# EAGLE design AVR-ISP-MK2 (EAGLE 9.5.2)
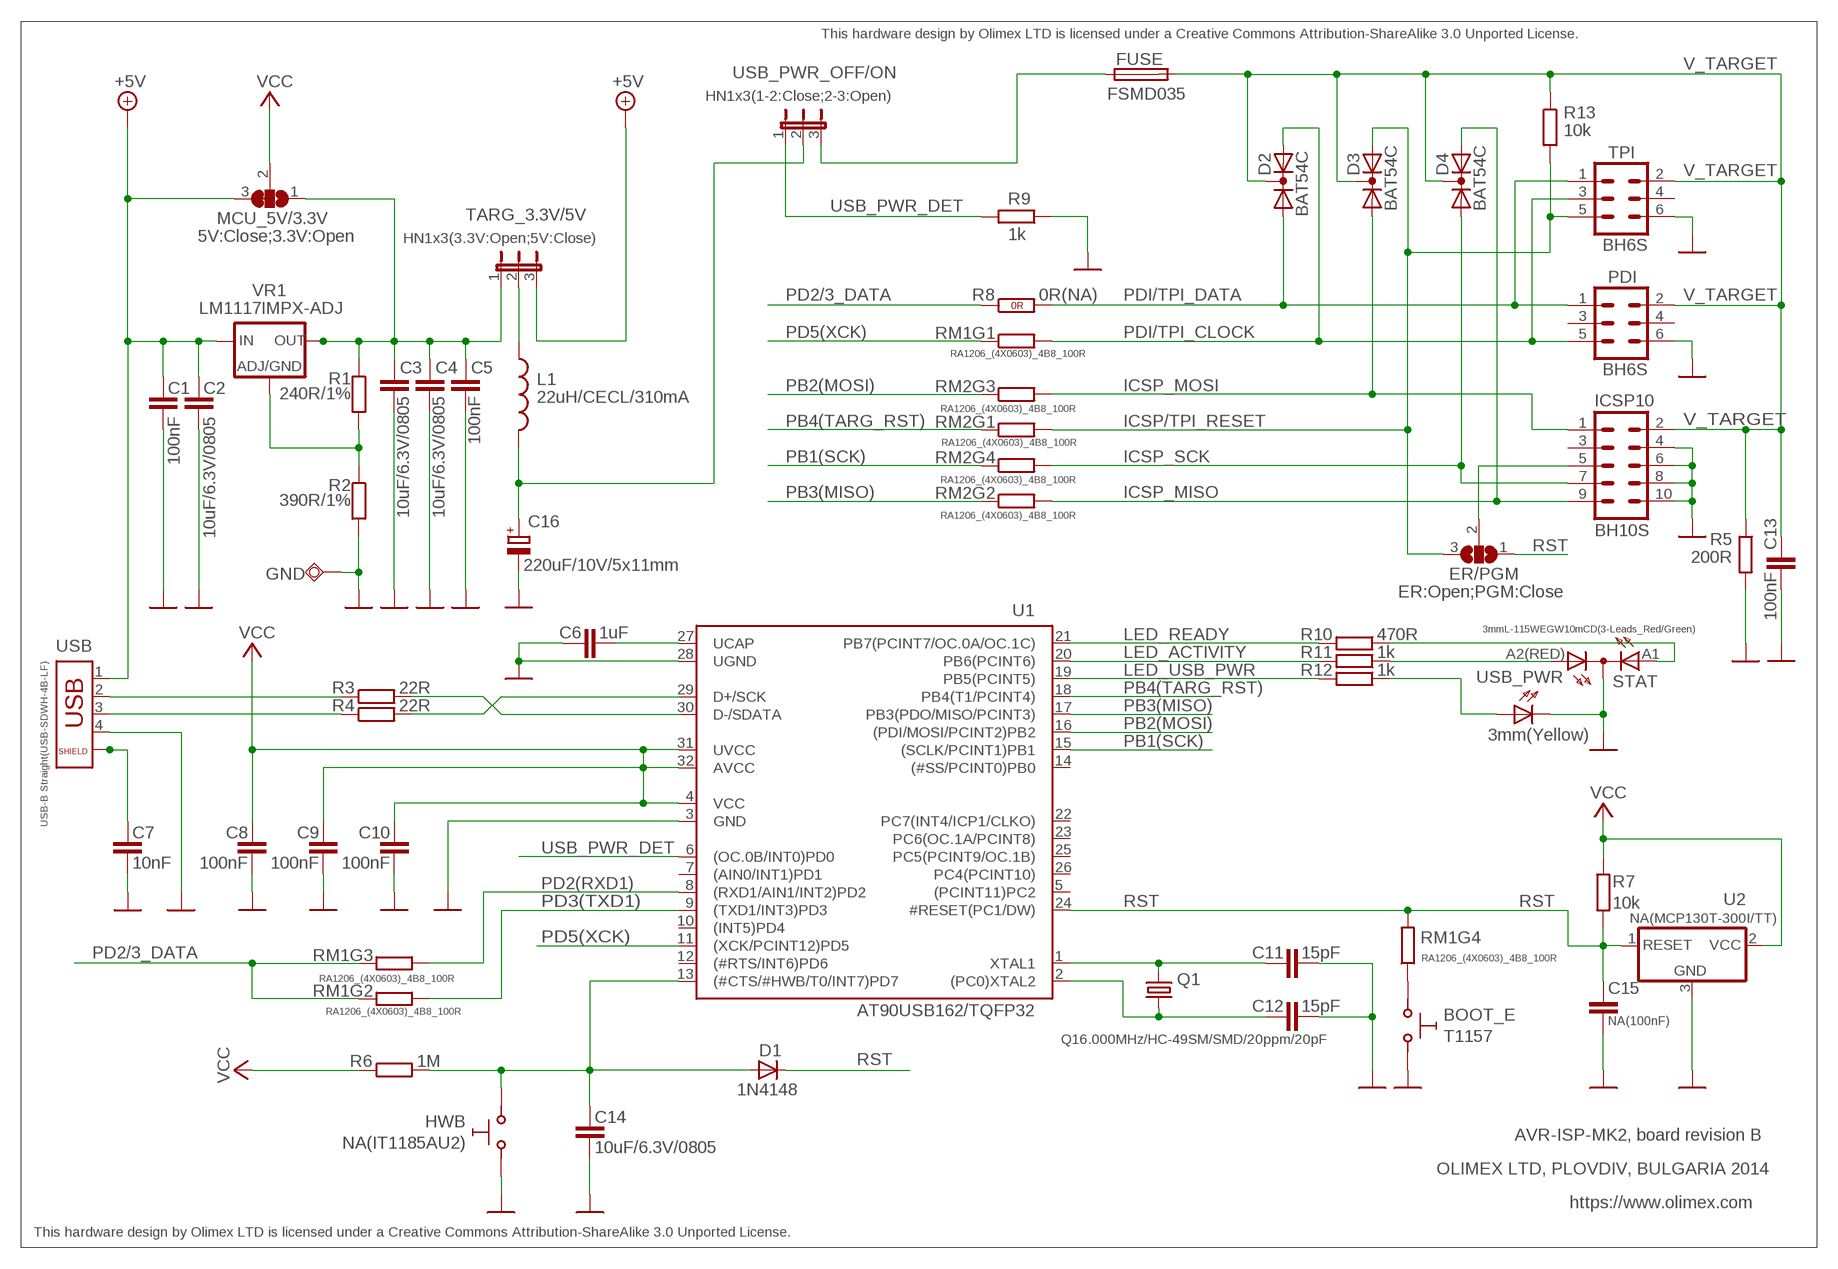
[diagram p0: schematic, sheet 1]

## Parts
BOOT_E  T1157  SW-TAKT""  [T1157]
C1  100nF  C-EUC0603_DWS  [C0603_DWS]
C2  10uF/6.3V/0805  C-EUC0805_5MIL_DWS  [C0805_5MIL_DWS]
C3  10uF/6.3V/0805  C-EUC0805_5MIL_DWS  [C0805_5MIL_DWS]
C4  10uF/6.3V/0805  C-EUC0805_5MIL_DWS  [C0805_5MIL_DWS]
C5  100nF  C-EUC0603_DWS  [C0603_DWS]
C6  1uF  C-EUC0603_DWS  [C0603_DWS]
C7  10nF  C-EUC0603_DWS  [C0603_DWS]
C8  100nF  C-EUC0603_DWS  [C0603_DWS]
C9  100nF  C-EUC0603_DWS  [C0603_DWS]
C10  100nF  C-EUC0603_DWS  [C0603_DWS]
C11  15pF  C-EUC0603_DWS  [C0603_DWS]
C12  15pF  C-EUC0603_DWS  [C0603_DWS]
C13  100nF  C-EUC0603_DWS  [C0603_DWS]
C14  10uF/6.3V/0805  C-EUC0805_5MIL_DWS  [C0805_5MIL_DWS]
C15  NA(100nF)  C-EUC0603_DWS_NA  [C0603_DWS_NA]
C16  220uF/10V/5x11mm  CPOL-EUC-SMD5X11  [C-SMD5X11]
D1  1N4148  DSMD  [MINI-MELF]
D2  BAT54C  DIODE_AC-CA_  [SOT23C]
D3  BAT54C  DIODE_AC-CA_  [SOT23C]
D4  BAT54C  DIODE_AC-CA_  [SOT23C]
ER/PGM  ER:Open;PGM:Close  SJ2W  [SJ_2]
FUSE  FSMD035  FUSE  [1206]
GND  TESTPAD3  [TEST_PAD40/70/SQUARE]
HWB  NA(IT1185AU2)  SW-TAKTIT1185AU2  [IT1185AU2]
ICSP10  BH10S  ML10SMD  [ML10_PADS]
L1  22uH/CECL/310mA  L-USCECL  [L_CECL]
MCU_5V/3.3V  5V:Close;3.3V:Open  SJ2W  [SJ_2]
PDI  BH6S  ML6ML6_PADS  [ML6_PADS]
Q1  Q16.000MHz/HC-49SM/SMD/20ppm/20pF  HC49/S1  [HC49/SMD2_THIN]
R1  240R/1%  R-EU_R0603_5MIL_DWS  [R0603_5MIL_DWS]
R2  390R/1%  R-EU_R0603_5MIL_DWS  [R0603_5MIL_DWS]
R3  22R  R-EU_R0603_5MIL_DWS  [R0603_5MIL_DWS]
R4  22R  R-EU_R0603_5MIL_DWS  [R0603_5MIL_DWS]
R5  200R  R-EU_R0805_5MIL_DWS  [R0805_5MIL_DWS]
R6  1M  R-EU_R0603_5MIL_DWS  [R0603_5MIL_DWS]
R7  10k  R-EU_R0603_5MIL_DWS  [R0603_5MIL_DWS]
R8  0R(NA)  R_0R0R(NA)  [0603_0R]
R9  1k  R-EU_R0603_5MIL_DWS  [R0603_5MIL_DWS]
R10  470R  R-EU_R0603_5MIL_DWS  [R0603_5MIL_DWS]
R11  1k  R-EU_R0603_5MIL_DWS  [R0603_5MIL_DWS]
R12  1k  R-EU_R0603_5MIL_DWS  [R0603_5MIL_DWS]
R13  10k  R-EU_R0603_5MIL_DWS  [R0603_5MIL_DWS]
RM1  RA1206_(4X0603)_4B8_100R  R_MATRIX_4E  [R_MATRIX_4]
RM2  RA1206_(4X0603)_4B8_100R  R_MATRIX_4E  [R_MATRIX_4]
STAT  3mmL-115WEGW10mCD(3-Leads_Red/Green)  2X3MMLED  [2X3MMLED]
TARG_3.3V/5V  HN1x3(3.3V:Open;5V:Close)  JP2EHN1X3_SMD_MIRROR  [HN1X3-SMD_MIRROR]
TPI  BH6S  ML6ML6_PADS  [ML6_PADS]
U1  AT90USB162/TQFP32  AT90USB82/162TQFP32  [TQFP32]
U2  NA(MCP130T-300I/TT)  RESETMCP130T-300-I/TT  [SOT23]
USB  USB-B Straight(USB-SDWH-4B-LF)  USB_SHIELDUSB_B_SMD  [USB_PADS]
USB_PWR  3mm(Yellow)  LED3.0MM  [LED-3.0MM]
USB_PWR_OFF/ON  HN1x3(1-2:Close;2-3:Open)  JP2EHN1X3-SMD  [HN1X3-SMD]
VR1  LM1117IMPX-ADJ  LM1117THERMAL_OFF  [SOT223_]

## Nets
+5V [PWR]: C1.1 C2.1 MCU_5V/3.3V.3 TARG_3.3V/5V.3 USB.1 VR1.3(IN)
GND [PWR]: BOOT_E.2 C1.2 C2.2 C3.2 C4.2 C5.2 C6.2 C7.2 C8.2 C9.2 C10.2 C11.1 C12.1 C13.2 C14.2 C15.2 C16.- GND.P$1(PP) HWB.2 ICSP10.4 ICSP10.6 ICSP10.8 ICSP10.10 PDI.6 R2.2 R5.2 R9.1 STAT.C TPI.6 U1.3(GND) U1.28(UGND) U2.3(GND) USB.4 USB_PWR.K(C)
ICSP/TPI_RESET: D3.1(A1) ER/PGM.3 R13.2 RM2.1.2 TPI.5
ICSP_MISO: D4.1(A1) ICSP10.9 RM2.2.2
ICSP_MOSI: D3.2(A2) ICSP10.1 RM2.3.2
ICSP_SCK: D4.2(A2) ICSP10.7 RM2.4.2
LED_ACTIVITY: R11.2 U1.20(PB6(PCINT6))
LED_READY: R10.2 U1.21(PB7(PCINT7/OC.0A/OC.1C))
LED_USB_PWR: R12.2 U1.19(PB5(PCINT5))
N$1: C14.1 D1.A HWB.1 R6.2 U1.13((#CTS/#HWB/T0/INT7)PD7)
N$2 [PWR]: C7.1 USB.P$5 USB.P$6
N$3: R11.1 STAT.A2(RED)(AR)
N$4: R12.1 USB_PWR.A
N$5: C3.1 C4.1 C5.1 MCU_5V/3.3V.1 R1.1 TARG_3.3V/5V.1 VR1.2(OUT) VR1.4(RAD)
N$6: R1.2 R2.1 VR1.1(ADJ/GND)
N$7: BOOT_E.1 RM1.4.1
N$8 [PWR]: L1.1 TARG_3.3V/5V.2
N$9: C16.+ L1.2 USB_PWR_OFF/ON.2
N$10: C6.1 U1.27(UCAP)
N$11: ER/PGM.2 ICSP10.5
N$12: FUSE.1 USB_PWR_OFF/ON.3
N$25: R10.1 STAT.A1(AG)
N$40: C11.2 Q1.2 U1.1(XTAL1)
N$42: C12.2 Q1.1 U1.2((PC0)XTAL2)
N$44: R3.2 U1.30(D-/SDATA)
N$45: R4.2 U1.29(D+/SCK)
N$438: R3.1 USB.2
N$537: R4.1 USB.3
PB1(SCK): RM2.4.1 U1.15((SCLK/PCINT1)PB1)
PB2(MOSI): RM2.3.1 U1.16((PDI/MOSI/PCINT2)PB2)
PB3(MISO): RM2.2.1 U1.17(PB3(PDO/MISO/PCINT3))
PB4(TARG_RST): RM2.1.1 U1.18(PB4(T1/PCINT4))
PD2(RXD1): RM1.3.1 U1.8((RXD1/AIN1/INT2)PD2)
PD2/3_DATA: R8.1(1.1) RM1.2.2 RM1.3.2
PD3(TXD1): RM1.2.1 U1.9((TXD1/INT3)PD3)
PD5(XCK): RM1.1.1 U1.11((XCK/PCINT12)PD5)
PDI/TPI_CLOCK: D2.2(A2) PDI.5 RM1.1.2 TPI.3
PDI/TPI_DATA: D2.1(A1) PDI.1 R8.2(1.2) TPI.1
RST: C15.1 D1.C(K) ER/PGM.1 R7.2 RM1.4.2 U1.24(#RESET(PC1/DW)) U2.1(RESET)
USB_PWR_DET: R9.2 U1.6((OC.0B/INT0)PD0) USB_PWR_OFF/ON.1
V_TARGET: C13.1 D2.3(K) D3.3(K) D4.3(K) FUSE.2 ICSP10.2 PDI.2 R5.1 R13.1 TPI.2
VCC: C8.1 C9.1 C10.1 MCU_5V/3.3V.2 R6.1 R7.1 U1.4(VCC) U1.31(UVCC) U1.32(AVCC) U2.2(VCC)
Unconnected: ICSP10.3 PDI.3 PDI.4 TPI.4 U1.5((PCINT11)PC2) U1.7((AIN0/INT1)PD1) U1.10((INT5)PD4) U1.12((#RTS/INT6)PD6) U1.14((#SS/PCINT0)PB0) U1.22(PC7(INT4/ICP1/CLKO)) U1.23(PC6(OC.1A/PCINT8)) U1.25(PC5(PCINT9/OC.1B)) U1.26(PC4(PCINT10))

## Notes on the sheet
- This hardware design by Olimex LTD is licensed under a Creative Commons Attribution-ShareAlike 3.0 Unported License.
- AVR-ISP-MK2, board revision B
- OLIMEX LTD, PLOVDIV, BULGARIA 2014
- https://www.olimex.com
- This hardware design by Olimex LTD is licensed under a Creative Commons Attribution-ShareAlike 3.0 Unported License.

## Library data of the parts
BOOT_E HWB = gogo:SW-TAKT
C1-C15 = rcl:C-EU: CAPACITOR, European symbol
C16 = rcl:CPOL-EU: POLARIZED CAPACITOR, European symbol
D1 = DOUBLE-SIDE:D: DIODES
D2-D4 = semicon-smd-ipc:DIODE_AC-CA_: DUAL DIODE
ER/PGM MCU_5V/3.3V = jumper:SJ2W: SMD solder JUMPER
FUSE = gogo:FUSE
GND = gogo:TESTPAD: drill 40mils, diameter 70mils
ICSP10 = con-harting-ml:ML10: HARTING
L1 = rcl:L-US: INDUCTOR, American symbol
PDI TPI = con-harting-ml:ML6: HARTING
Q1 = crystal:HC49/S: CRYSTAL
R1-R7 R9-R13 = rcl:R-EU_: RESISTOR, European symbol
R8 = OLIMEX_DISCRET:R_0R
RM1 RM2 = OLIMEX_DISCRET:R_MATRIX_4E
STAT = gogo:2X3MMLED: COMMON CATHODE
TARG_3.3V/5V USB_PWR_OFF/ON = jumper:JP2E: JUMPER
U1 = OLIMEX_IC:AT90USB82/162
U2 = gogo:RESET: Microcontroller Supervisory Circuit with Open Drain Output
USB = OLIMEX_CONNECTORS:USB_SHIELD
USB_PWR = DOUBLE-SIDE:LED
VR1 = arm:LM1117

## Net classes
1 PWR: width 0.5 mm

## Board
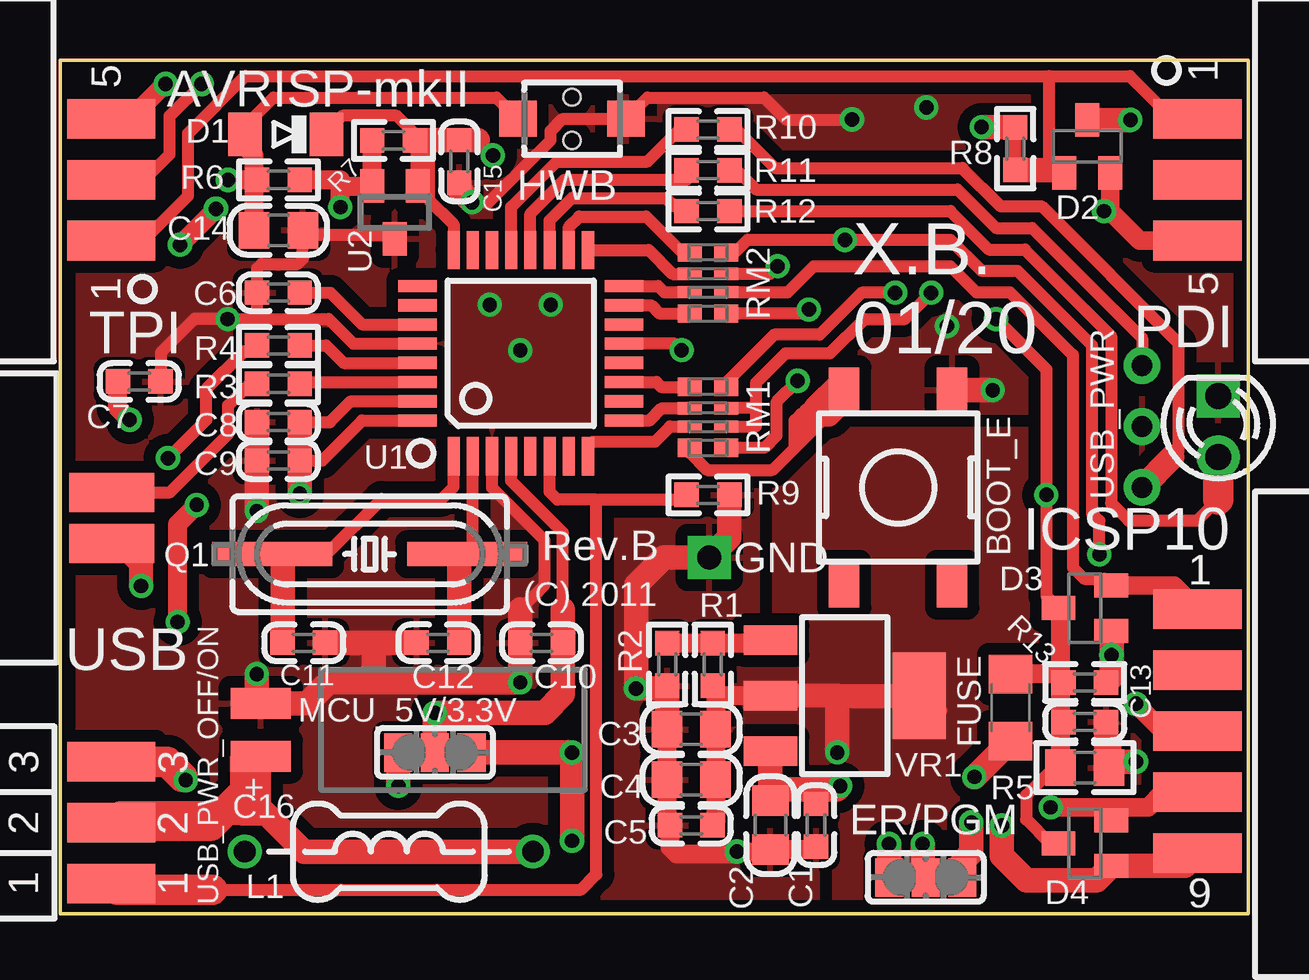
[diagram p1: board, top side]
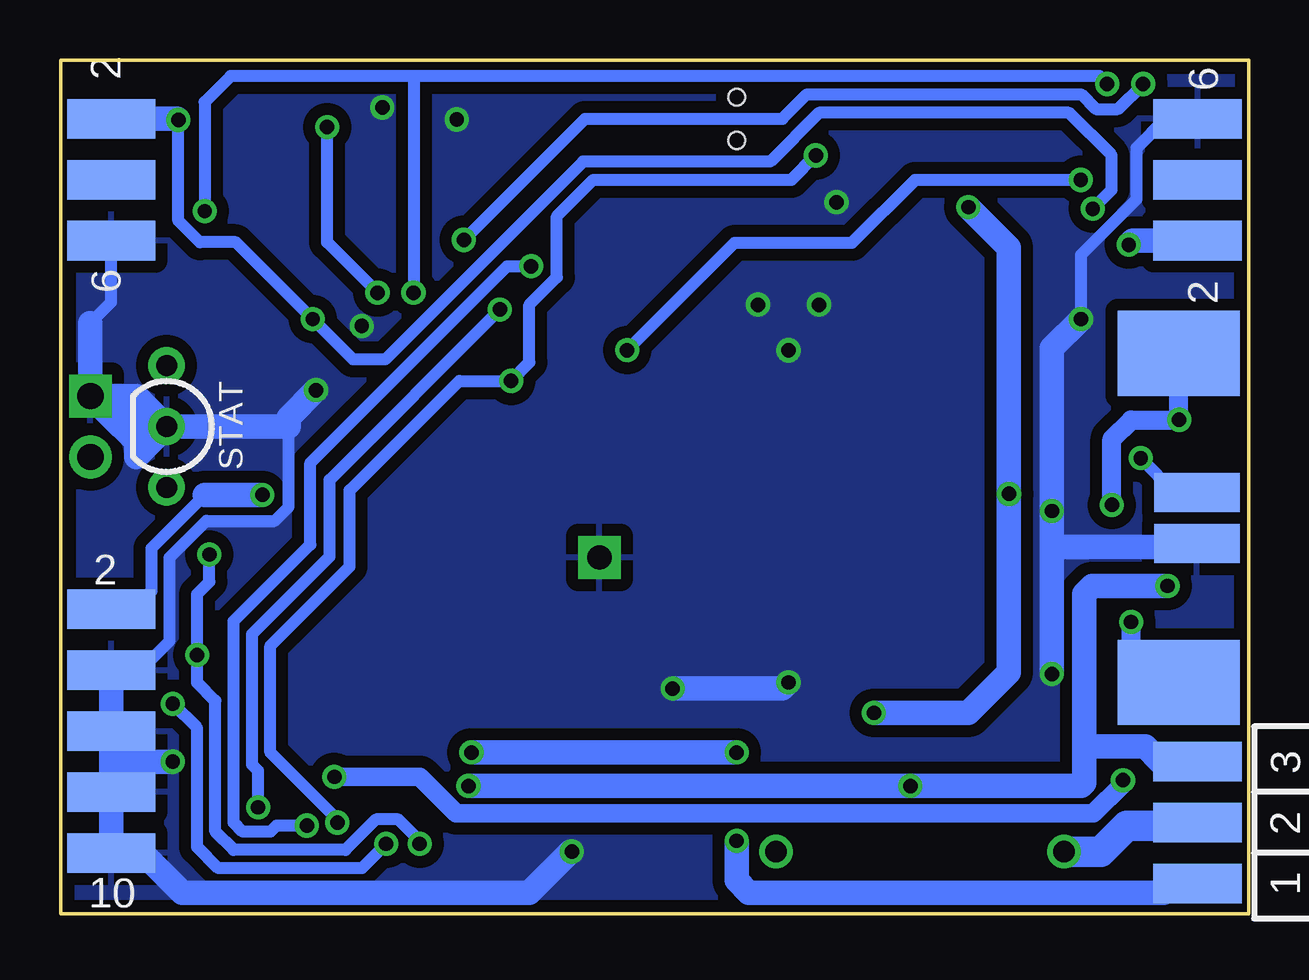
[diagram p2: board, bottom side, seen from below]

Size 49.5 x 35.6 mm. Coordinates in mm from the lower left corner, seen from the top.
Outline: 0,0 49.5,0 49.5,35.6 0,35.6 0,0
Copper layers (1+16): Top 0.035mm / dielectric 1.5mm / Bottom 0.035mm
Design rules "default": minimum track width 10mil, minimum drill 0.6mm, track to track 10mil, track to pad 10mil, pad to pad 10mil, via to via 10mil, smd to smd 1mil, copper to edge 10mil, drill to drill 8mil, minimum pad ring 10mil, minimum via ring 8mil, stop-mask expansion 4mil, vias tented up to drill 25mil, thermal gap 20mil
tRestrict: 2 lines
bRestrict: 2 lines

### Footprints (pad centres in the part's own frame; a part is rotated, then mirrored left to right if it is on the bottom)
T1157 = smd 1.27 x 1.905: 1 -2.25,4.054; 2 2.25,4.054; 3 2.25,-4.054; 4 -2.25,-4.054
C0603_DWS = smd 1.016 x 1.016: 1 -0.889,0; 2 0.889,0
C0805_5MIL_DWS = smd 1.27 x 1.524: 1 -1.016,0; 2 1.016,0
C0603_DWS_NA = smd 1.016 x 1.016: 1 -0.889,0; 2 0.889,0
C-SMD5X11 = smd 2.5 x 1.3: + 0,1.1; - 0,-1.1
MINI-MELF = smd 1.4 x 1.8: A 1.7,0; C -1.7,0
SOT23C = smd 1 x 1.4: 1 -0.95,-1.1; 2 0.95,-1.1; 3 0,1.1
SJ_2 = smd 1.168 x 1.6: 1 -1.524,0; 2 0,0; 3 1.524,0
1206 = smd 1.6 x 1.8: 1 -1.4,0; 2 1.4,0
TEST_PAD40/70/SQUARE = drill 1.016 pad 1.778 square: P$1 0,0
IT1185AU2 = smd 1.55 x 1.5: 1 -2.25,0; 2 2.25,0 | hole 0.7: 0,-0.9; 0,0.9
ML10_PADS = smd 1.651 x 3.683: 1 -5.08,-0.229; 3 -2.54,-0.229; 5 0,-0.229; 7 2.54,-0.229; 9 5.08,-0.229 | smd 1.651 x 3.683 bottom: 2 -5.08,-0.229; 4 -2.54,-0.229; 6 0,-0.229; 8 2.54,-0.229; 10 5.08,-0.229
L_CECL = drill 0.9: 1 -6,0; 2 6,0
ML6_PADS = smd 1.651 x 3.683: 1 -2.54,-0.229; 3 0,-0.229; 5 2.54,-0.229 | smd 1.651 x 3.683 bottom: 2 -2.54,-0.229; 4 0,-0.229; 6 2.54,-0.229
HC49/SMD2_THIN = smd 5 x 1: 1 -4.064,0; 2 4.064,0
R0603_5MIL_DWS = smd 1.016 x 1.016: 1 -0.889,0; 2 0.889,0
R0805_5MIL_DWS = smd 1.27 x 1.524: 1 -1.016,0; 2 1.016,0
0603_0R = smd 1.016 x 1.016: 1 -0.889,0; 2 0.889,0
R_MATRIX_4 = smd 1.016 x 0.762: 1.1 -0.762,1.27; 1.2 0.762,1.27; 4.1 -0.762,-1.27; 4.2 0.762,-1.27 | smd 1.016 x 0.508: 2.1 -0.762,0.381; 2.2 0.762,0.381; 3.1 -0.762,-0.381; 3.2 0.762,-0.381
2X3MMLED = drill 0.864 pad 1.524: A1 -2.54,0; A2(RED) 2.54,0; C 0,0
HN1X3-SMD_MIRROR = smd 1.651 x 3.683: 1 2.54,-0.229; 2 0,-0.229; 3 -2.54,-0.229
TQFP32 = smd 0.508 x 1.6: 1 -2.8,-4.3; 2 -2,-4.3; 3 -1.2,-4.3; 4 -0.4,-4.3; 5 0.4,-4.3; 6 1.2,-4.3; 7 2,-4.3; 8 2.8,-4.3; 17 2.8,4.3; 18 2,4.3; 19 1.2,4.3; 20 0.4,4.3; 21 -0.4,4.3; 22 -1.2,4.3; 23 -2,4.3; 24 -2.8,4.3 | smd 1.6 x 0.508: 9 4.3,-2.8; 10 4.3,-2; 11 4.3,-1.2; 12 4.3,-0.4; 13 4.3,0.4; 14 4.3,1.2; 15 4.3,2; 16 4.3,2.8; 25 -4.3,2.8; 26 -4.3,2; 27 -4.3,1.2; 28 -4.3,0.4; 29 -4.3,-0.4; 30 -4.3,-1.2; 31 -4.3,-2; 32 -4.3,-2.8
SOT23 = smd 1 x 1.4: 1 -0.95,-1.1; 2 0.95,-1.1; 3 0,1.1
USB_PADS = smd 1.626 x 3.556: 1 1.067,10.287; 2 -1.067,10.287 | smd 1.626 x 3.556 bottom: 3 -1.067,10.287; 4 1.067,10.287 | smd 3.556 x 5.08 bottom: P$5 -6.858,11.049; P$6 6.858,11.049
LED-3.0MM = drill 1.092 pad 1.778: A -1.27,0 | drill 1.092 pad 1.778 square: K 1.27,0
HN1X3-SMD = smd 1.651 x 3.683: 1 -2.54,-0.229; 2 0,-0.229; 3 2.54,-0.229
SOT223_ = smd 1.219 x 2.235: 1 -2.311,-3.099; 2 0,-3.099; 3 2.311,-3.099 | smd 3.6 x 2.2: 4 0,3.099

### Placement (x,y rotation side)
BOOT_E  34.92,17.78 0 top
C1  31.5,3.7 270 top
C2  29.6,3.7 270 top
C3  26.3,7.7 180 top
C4  26.3,5.6 180 top
C5  26.3,3.7 180 top
C6  9.1,25.9 180 top
C7  3.3,22.2 0 top
C8  9.1,20.5 180 top
C9  9.1,18.9 180 top
C10  20.07,11.3 180 top
C11  10.16,11.3 180 top
C12  15.75,11.3 0 top
C13  42.7,8 0 top
C14  9.1,28.5 0 top
C15  16.64,31.37 270 top
C16  8.37,7.67 180 top
D1  9.4,32.5 180 top
D2  42.8,32 0 top
D3  42.7,12.75 90 top
D4  42.7,2.95 90 top
ER/PGM  36.07,1.52 180 top
FUSE  39.6,8.6 90 top
GND  27.05,14.86 0 top
HWB  21.34,33.15 0 top
ICSP10  47.62,7.62 270 top
L1  13.7,2.6 0 top
MCU_5V/3.3V  15.62,6.73 180 top
PDI  47.62,30.61 270 top
Q1  12.9,15 180 top
R1  27.2,10.4 90 top
R2  25.3,10.4 270 top
R3  9.1,22.1 0 top
R4  9.1,23.7 0 top
R5  42.7,6.1 0 top
R6  9.1,30.6 180 top
R7  13.9,32.25 0 top
R8  39.8,31.9 270 top
R9  27,17.47 180 top
R10  27,32.7 180 top
R11  27,31 180 top
R12  27,29.3 180 top
R13  42.7,9.65 0 top
RM1  27,20.7 0 top
RM2  27,26.3 0 top
STAT  45.09,20.32 90 bottom
TARG_3.3V/5V  1.91,3.81 270 bottom
TPI  1.91,30.61 90 top
U1  19.2,23.37 0 top
U2  13.95,29.25 180 top
USB  -8.13,16.51 270 top
USB_PWR  48.26,20.32 90 top
USB_PWR_OFF/ON  1.91,3.81 90 top
VR1  32.7,9.1 270 top

### Tracks (layer width: path | path; a pad name or v marks a point on that pad's centre or on a via)
+5V  (via drill 0.6)
  Top 0.5: 29.6,5.2
  Top 0.508: MCU_5V/3.3V.3 15.62,6.73
  Top 0.8: 31.5,5.2 C1.1 | 29.6,5.2 C2.1
  Top 1: USB.1 2.56,15.44 3.38,14.62 v3.38,13.67
  Top 1.016: VR1.3 29.6,5.2 31.5,5.2 32.38,5.2 v32.51,5.33 | v14.1,5.33 MCU_5V/3.3V.3
  Bottom 1.016: 6.86,6.99 6.86,5.46 6.99,5.33 v14.1,5.33 v32.51,5.33 | v3.38,13.67 6.52,13.67 6.86,13.34 6.86,6.99 | TARG_3.3V/5V.3 3.68,6.35 4.32,6.99 6.86,6.99
GND  (via drill 0.6)
  Top 0.5: U1.28 12.22,23.77 11.19,24.8 8.21,24.8 | 8.21,24.8 C6.2 8.21,26.91 8.4,27.1 9.9,27.1 10.12,27.32 10.12,28.32 | 8.21,24.8 v6.99,24.8 5.6,24.8 4.2,23.4 C7.2 | 29.52,2.6 C2.2 | 25.3,7.72 C3.2 | U1.3 18,17.76 20.19,15.57 20.19,13.72 19.18,12.7 | R5.2 43.7,6.1 | 10.12,28.32 13.95,28.32 U2.3 | 10.12,28.32 C14.2
  Top 0.508: v33,33.12 30.25,33.12 29.34,34.04 24.48,34.04 HWB.2 20.95,33.15 20.45,32.64 20.45,32.26 17.86,29.67 v17.17,29.67
  Top 0.8: C3.2 C4.2 25.28,3.83 C5.2 25.41,2.79 25.7,2.5 28.1,2.5 v28.2,2.6 29.52,2.6 | C2.2 31.37,2.68 C1.2
  Top 1.016: C8.2 C9.2 8.21,18.91 C9.2 v8.2,16.8 | 25.3,8.78 25.3,7.72 | 25.3,8.78 R2.2 | 13.08,9.65 13.08,11.3 | 13.08,11.3 C11.1 | 13.08,11.3 C12.1 | 19.18,12.7 C10.2 v19.18,9.65 13.08,9.65 | 13.08,9.65 11.18,9.65 10.3,8.78 C16.- 8.2,8.78 v8.2,10 | v38.87,21.83 BOOT_E.2 | R9.1 27.89,15.7 GND.P$1 25.15,14.86 24,13.72 v24,9.4 25.3,9.4 25.3,8.78 | v44.83,6.35 43.72,6.35 | C13.2 43.59,6.99 43.72,6.99 43.72,6.35 | 43.72,6.35 R5.2 | v17.17,29.67 16.64,30.2 C15.2
  Bottom 0.5: PDI.6 47.4,25.5 48.26,24.64 | v28.2,2.6 28.28,2.6 | ICSP10.4 46.89,10.67 | TPI.6 3.45,33.15 4.67,31.93 4.67,29.79 6.99,27.48 v6.99,24.8
  Bottom 0.508: 46.89,10.67 45.67,10.67 44.96,11.38 44.96,14.86 43.43,16.38 40.59,16.38 40,16.97 40,20.32
  Bottom 0.813: 46.1,2.54 ICSP10.10
  Bottom 1.016: 8.2,15.3 2.16,15.3 USB.4 | 47.4,6.35 ICSP10.6 ICSP10.4 | STAT.C 46.35,21.59 | 46.35,21.59 USB_PWR.K | USB_PWR.K 48.26,24.64 | v38.87,21.83 40,20.7 40,20.32 STAT.C | 28.28,2.6 29.99,0.89 44.45,0.89 46.1,2.54 | v19.18,9.65 19.43,9.4 v24,9.4 | v6.99,24.8 8.2,23.59 v8.2,16.8 8.2,15.3 | v8.2,10 8.2,15.3 | 47.4,6.35 ICSP10.8 ICSP10.10 | 47.4,6.35 v44.83,6.35 | 46.35,19.68 46.35,19.05 STAT.C | 46.35,21.59 46.35,20.83 | 46.35,19.68 46.35,20.83 | 46.35,19.68 47.5,20.83 | USB_PWR.K 47.5,20.83 | 46.35,20.83 47.5,20.83
  other vias: 36.1,33.62 19.18,23.5 17.91,25.4 20.45,25.4 36.96,24.51
  pour Top (isolate 0.5, rank 3): -1,-1 50.5,-1 50.5,36.5 -1,36.5
  pour Bottom (isolate 0.5, rank 3): -2,-2 51.5,-2 51.5,37.5 -2,37.5
ICSP/TPI_RESET  (via drill 0.6)
  Top 0.5: RM2.1.2 28.11,27.57 28.64,28.1 v32.7,28.1 37.1,28.1 38.4,26.8 39.9,26.8 43,23.7 43,16.69 43.31,16.38 v43.31,14.99 | v4.4,34.6 4.4,34.63
  Top 0.813: TPI.5 2.92,33.15 4.4,34.63
  Top 1.016: R13.2 43.81,9.87 v43.81,10.79 43.81,11.8 D3.1 | ER/PGM.3 v34.54,2.92
  Bottom 0.5: v4.4,34.6 5.45,33.55 6.37,33.55 6.99,34.16 18.41,34.16 19.43,33.15 27.65,33.15 v32.7,28.1 | v43.81,10.79 43.81,13.34 43.31,13.84 v43.31,14.99
  Bottom 0.508: v34.54,2.92 34.54,3.05 35.43,3.94 36.37,3.94 37.64,2.67 42.29,2.67 43.05,3.43 43.05,8.89 43.81,9.65 v43.81,10.79
ICSP_MISO  (via drill 0.6)
  Top 0.5: v29.9,27 29.58,26.68 RM2.2.2
  Top 1.016: ICSP10.9 46.86,2 D4.1 43.2,1.4 40.26,1.4 39.24,2.41 v39.24,3.68
  Bottom 0.5: v39.24,3.68 40.51,3.68 40.77,3.43 41.91,3.43 42.29,3.81 42.29,12.21 39.1,15.4 39.1,18.8 30.9,27 v29.9,27
ICSP_MOSI
  Top 0.5: RM2.3.2 30.32,25.92 31.4,27 37.1,27 38.18,25.92 39.58,25.92 42.2,23.3 42.2,14.44 42.67,13.97 43.53,13.97 D3.2
  Top 0.762: ICSP10.1 46.4,13.7 D3.2
ICSP_SCK  (via drill 0.6)
  Top 0.5: v31.2,25.2 31.18,25.2 31.01,25.03 RM2.4.2
  Top 0.762: 43.8,4.45 45.34,4.45 45.97,5.08 ICSP10.7 | 43.8,4.45 D4.2 | v41.27,4.45 43.8,4.45
  Bottom 0.5: v41.27,4.45 41.27,5.97 41.53,6.22 41.53,11.67 38.3,14.9 38.3,18.1 v31.2,25.2
LED_ACTIVITY
  Top 0.5: U1.20 19.6,29.19 21.02,30.61 26.11,30.61 R11.2
LED_READY
  Top 0.5: U1.21 18.8,29.46 20.7,31.37 24.47,31.37 25.8,32.7 R10.2
LED_USB_PWR
  Top 0.5: U1.19 20.4,28.92 21.33,29.85 25.27,29.85 25.61,29.5 25.91,29.5 R12.2
N$1  (via drill 0.6)
  Top 0.5: U1.13 25.64,23.77 v25.91,23.5 v25.9,23.5 | 8.08,30.6 R6.2
  Top 0.508: HWB.1 18.2,34.04 8.89,34.04 7.7,32.85 D1.A
  Top 0.8: C14.1 8.08,30.6 | 8.08,30.6 8.08,31.62 7.7,32 D1.A | 8.08,30.6 v7,30.6
  Bottom 0.5: v25.9,23.5 21.43,27.96 16.54,27.96 13.9,30.6 v7,30.6
N$2  (via drill 0.6)
  Top 0.8: C7.1 2.41,21.09 v2.9,20.6 | v4.9,12.17 4.9,16.25 v5.7,17.05
  Bottom 0.5: 2.92,20.6 v2.9,20.6
  Bottom 0.8: USB.P$5 2.92,20.6 4.9,20.6 5.7,19.8 v5.7,17.05 | USB.P$6 2.92,10.92 4.67,10.92 4.9,11.15 v4.9,12.17
N$3
  Top 0.5: R11.1 28.2,31 29,30.2 37.4,30.2 39,28.6 40.5,28.6 45.09,24.02 STAT.A2(RED)
N$4
  Top 0.5: R12.1 37.1,29.3 38.7,27.7 40.2,27.7 43.8,24.1 43.8,17.13 44.53,16.4 47.39,16.4 48.26,17.27
  Top 1.27: 48.26,17.27 USB_PWR.A
N$5  (via drill 0.6)
  Top 0.5: 36.72,8.48 36.1,9.1 VR1.4 | 27.32,3.83 C5.1
  Top 0.8: 27.32,9.1 C3.1 C4.1 27.32,3.83 | VR1.2 27.32,9.1 | 27.32,9.1 27.32,9.39 R1.1
  Top 1: VR1.2 32.38,9.1 VR1.4
  Top 1.016: MCU_5V/3.3V.1 v21.34,6.73 v21.34,3.05 | v32.38,6.73 32.38,9.1
  Bottom 1.016: v21.34,6.73 v32.38,6.73 | v21.34,3.05 21.34,1.4 20.83,0.89 3.53,0.89 3.15,1.27 TARG_3.3V/5V.1
  pour Top (isolate 0.5, rank 2): 28.1,12.3 29.8,12.3 29.8,20.2 41,20.2 41,-3 -3,-3 -3,-1 32.3,-0.9 32.3,5.8 28.1,5.8
N$6
  Top 0.8: R2.1 R1.2 29.09,11.29 29.21,11.41 VR1.1
N$7
  Top 0.508: RM1.4.1 26.24,19.23 26.95,18.52 29.69,18.52 30.61,19.43 | 30.61,19.43 30.61,19.94 | 30.61,19.94 30.61,20.57 30.86,20.83 31.24,20.83 | 30.61,19.43 32,20.83 | 30.61,19.94 31.5,20.83
  Top 1.016: 31.5,20.83 31.24,20.83 | 31.5,20.83 32,20.83 32.67,21.5 BOOT_E.1 | 32.55,22.13 31.5,21.08 31.5,20.83
N$8
  Bottom 1.27: TARG_3.3V/5V.2 2.26,3.68 5.08,3.68 6.16,2.6 L1.1
N$9
  Top 0.5: 8.3,4.45 8.3,4.47
  Top 0.508: 5.97,4.45 5.46,4.45 | 5.97,4.45 8.3,4.45 | 5.97,4.45 5.97,4.19 5.97,3.56 5.97,3.43
  Top 1: 10.17,2.6 8.3,4.47 8.3,6.58 | 8.3,6.58 C16.+ | 7.6,4.19 6.99,4.19 6.35,3.56 5.95,3.56 | 7.6,4.19 8.51,4.19 | 7.6,5.19 7.6,4.19 | 7.6,5.19 7.62,5.21 | 5.97,3.56 7.6,5.19 | 7.6,5.19 7.6,6.58 8.3,6.58
  Top 1.016: 10.17,2.6 L1.2 | 6.22,4.19 5.97,4.19 2.52,4.19 USB_PWR_OFF/ON.2 | 5.97,3.56 5.95,3.56 2.13,3.56
N$10
  Top 0.5: U1.27 12.59,24.57 11.27,25.9 C6.1
N$11  (via drill 0.6)
  Top 0.762: ICSP10.5 45.97,7.62 v44.83,8.76
  Top 1.016: ER/PGM.2 35.94,1.65 v35.94,2.92
  Bottom 0.508: v44.83,8.76 43.81,7.75 43.81,2.79 42.93,1.91 36.96,1.91 v35.94,2.92
N$12  (via drill 0.6)
  Top 1.016: v38.1,5.71 v38.1,5.7 FUSE.1 | 5.1,5.71 v5.24,5.57
  Top 1.27: USB_PWR_OFF/ON.3 4.46,6.35 5.1,5.71
  Bottom 0.762: v38.1,5.71 34.54,5.71 33.02,4.19 6.48,4.19 5.24,5.43 v5.24,5.57
N$25
  Top 0.5: R10.1 28.2,32.7 29.8,31.1 37.6,31.1 39.2,29.5 40.9,29.5 46.6,23.8 46.6,19.3 46.35,19.04
  Top 1.016: 46.35,19.04 STAT.A1
N$40
  Top 0.5: U1.1 16.4,17.8 15.9,17.3 13.4,17.3 11.1,15 9.27,15 Q1.2
  Top 1.016: C11.2 9.27,15
N$42
  Top 0.5: 16.64,15 Q1.1 17.2,15.24 U1.2
  Top 1.016: C12.2 16.64,15
N$44
  Top 0.5: U1.30 10.07,22.17 R3.2
N$45
  Top 0.5: U1.29 11.82,22.97 11.09,23.7 R4.2
N$438
  Top 0.5: 7.9,22.1 7,21.2 7,20 4.58,17.58 USB.2
  Top 0.508: 7.9,22.1 R3.1
N$537  (via drill 0.6)
  Top 0.5: 6.1,21.9 6.1,20.6 v4.5,19
  Top 0.508: R4.1 7.96,23.45 7.65,23.45 6.1,21.9
  Bottom 0.5: USB.3 3.08,17.58 v4.5,19
PB1(SCK)
  Top 0.5: U1.15 24.63,25.37 24.97,25.03 RM2.4.1
PB2(MOSI)
  Top 0.5: U1.16 24.93,26.17 25.18,25.92 RM2.3.1
PB3(MISO)
  Top 0.5: U1.17 24.53,27.67 25.52,26.68 RM2.2.1
PB4(TARG_RST)
  Top 0.5: U1.18 21.2,28.65 21.63,29.07 24.43,29.07 25.93,27.57 RM2.1.1
PD2(RXD1)
  Top 0.5: U1.8 22,19.5 22.19,19.69 24.79,19.69 25.42,20.32 RM1.3.1
PD2/3_DATA  (via drill 0.6)
  Top 0.5: RM1.3.2 29,20.32 29,21.08 | 39.8,32.8 R8.1 | 29,21.08 RM1.2.2 | 29,21.08 29,22.14 30.23,23.38 32.08,23.38 33.5,24.8 35.2,24.8 v36.3,25.9
  Top 1.016: v38.4,32.8 39.8,32.8
  Bottom 0.5: v36.3,25.9 38.4,28 v38.4,32.8
PD3(TXD1)
  Top 0.5: U1.9 24.57,20.57 25.08,21.08 RM1.2.1
PD5(XCK)
  Top 0.5: U1.11 24.85,22.17 25.05,21.97 RM1.1.1
PDI/TPI_CLOCK  (via drill 0.6)
  Top 0.5: v43.5,29.3 43.75,29.3 | RM1.1.2 27.76,22.16 29.75,24.15 31.65,24.15 33.4,25.9 v34.8,25.9 | TPI.3 3.51,30.61 4.57,31.67 4.57,33.27 v5.9,34.6
  Top 0.762: PDI.5 44.98,28.07 43.75,29.3 D2.2
  Bottom 0.5: v5.9,34.6 6.22,34.92 34.8,34.92 | 34.8,34.92 v34.8,25.9 | 34.8,34.92 42.42,34.92 43.5,33.84 v43.5,29.3
PDI/TPI_DATA
  Top 0.5: 41.2,34.92 7.72,34.92 5.33,32.53 5.33,29.93 3.47,28.07 TPI.1 | 46.35,33.15 PDI.1
  Top 0.508: 46.35,33.15 44.58,34.92 41.2,34.92 41.2,31.01
  Top 1.016: D2.1 41.74,31.01 41.2,31.01 R8.2
RST  (via drill 0.6)
  Top 0.5: U1.24 16.4,28.75 15.37,29.78 15.37,30.35 15.11,30.35
  Top 0.508: D1.C 11.4,32.8 11.4,32.92 11.76,33.27 14.04,33.27 14.79,32.52 R7.2 | v18.03,31.62 17.4,32.26 | RM1.4.2 29.34,19.43 29.84,19.94 29.84,21.34 v30.73,22.23
  Top 0.8: 15.11,32.26 15.11,32.25
  Top 1.016: U2.1 15.11,30.35 15.11,32.25 R7.2 | 15.11,32.26 C15.1 17.4,32.26 | ER/PGM.1 37.59,2.16 37.97,2.54 v37.97,3.81
  Bottom 0.5: v18.03,31.62 19.05,30.61 27.3,30.61 28.83,29.08 28.83,26.54 29.97,25.4 29.97,22.99 v30.73,22.23
  Bottom 0.508: v37.97,3.81 37.97,3.94 40.77,6.73 40.77,11.18 37.47,14.48 37.47,17.65 32.89,22.23 v30.73,22.23
USB_PWR_DET
  Top 0.5: U1.6 20.4,17.59 20.72,17.27
  Top 0.508: 22.35,17.27 20.72,17.27 | 6.35,1.02 21.72,1.02 22.35,1.65 22.35,17.27 | R9.2 25.91,17.27 22.35,17.27
  Top 1.27: USB_PWR_OFF/ON.1 2.39,1.02 6.35,1.02
V_TARGET  (via drill 0.6)
  Top 0.5: D4.3 41.25,2.95 40.26,3.94 40.26,4.95 41.41,6.1 R5.1 | 41.68,9.65 R13.1 | 41.68,8 C13.1 | 41.68,12.75 D3.3 41.1,13.25 v41.1,17.47 41.1,22.7 v39,24.8
  Top 0.762: v5,27.9 v6.5,29.4
  Top 0.8: R5.1 41.68,8 41.68,9.65 41.68,10 | 41.68,12.75 41.68,10 | 41.68,10 FUSE.2
  Top 1.016: v44.6,33.1 D2.3
  Bottom 0.5: 44.65,33.15 v44.6,33.1 44.6,28.9 43.7,28 42.2,28 v39,24.8 37.31,23.11 35.99,23.11 27.73,31.37 19.94,31.37 17.91,33.4 7.49,33.4 5.71,31.62 5.71,30.18 v6.5,29.4 | ICSP10.2 46.48,12.7 45.72,13.46 45.72,15.24 43.49,17.47
  Bottom 1.016: 44.65,33.15 PDI.2 | v41.1,17.47 43.49,17.47 | TPI.2 4.83,28.07 v5,27.9
VCC  (via drill 0.6)
  Top 0.5: U1.32 12.59,20.57 10.92,18.9 C9.1 | U1.31 12.12,21.37 11.25,20.5 C8.1 | U1.4 18.8,18.05 20.95,15.9 20.95,12.7 | 13,32.23 R7.1
  Top 0.8: 11.68,30.35 11.68,30.6 R6.1 | v11.68,29.46 11.68,30.35 | 11.68,30.35 U2.2 13,32.23
  Top 1.016: C8.1 C9.1 v9.99,17.51 | 20.95,12.7 C10.1 20.95,9.14 20.19,8.38 v15.62,8.38 MCU_5V/3.3V.2
  Bottom 1.016: v15.62,8.38 11.68,8.38 9.99,10.08 v9.99,17.51 9.99,27.77 v11.68,29.46

### Text on the board
tPlace: +
tNames: AVRISP-mkII | X.B. / 01/20 | Rev.B | (C) 2011 | 3 | 2 | 1
bStop: A2(RED) | X.B. | A1 | AVRISP-mkII | 3 | 2 | 1